# Altium schematic sheet Avometer v1.1.1.SchDoc
size A3
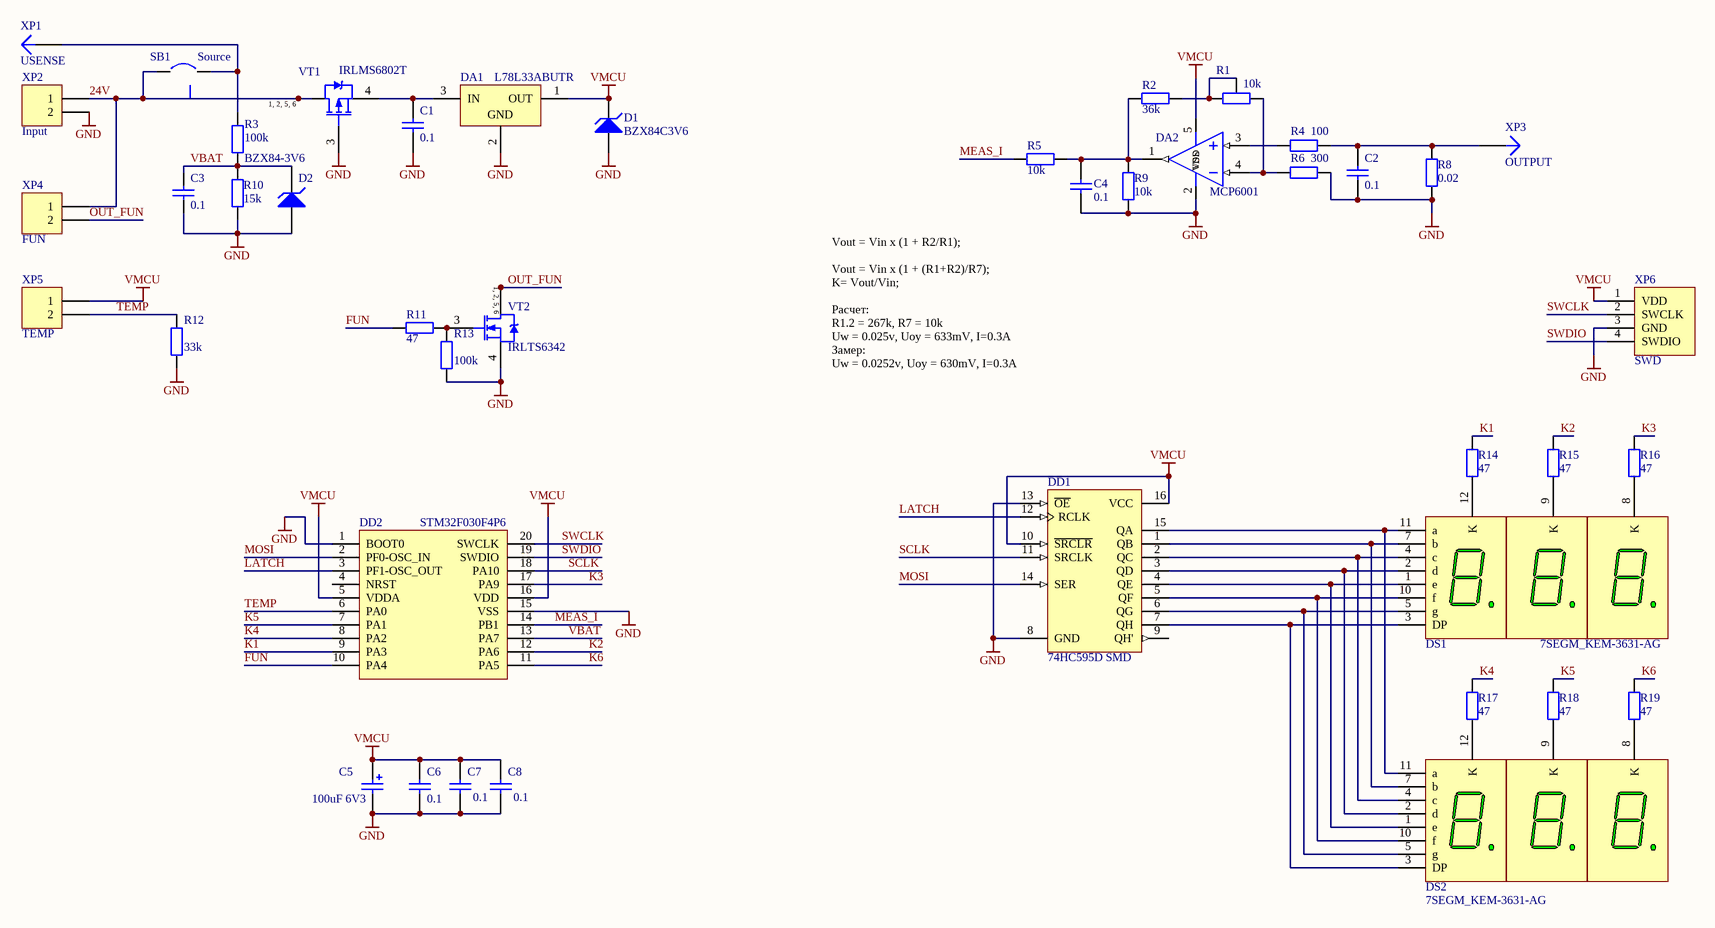
[diagram p0: Avometer v1.1.1.SchDoc]

## Parts
C1  0.1  [CAP 0603_N]
C2  0.1  [CAP 0603_N]
C3  0.1  [CAP 0603_N]
C4  0.1  [CAP 0603_N]
C5  100uF 6V3  [CAP_TANT_B_TYPE_3528-21]
C6  0.1  [CAP 0603_N]
C7  0.1  [CAP 0603_N]
C8  0.1  [CAP 0603_N]
D1  BZX84C3V6  [SOT-23_L]
D2  BZX84-3V6  [SOT-23_L]
DA1  L78L33ABUTR  [SOT-89]
DA2  MCP6001  [SOT-23-5_L]
DD1  74HC595D SMD  [SOIC-16_L]
DD2  STM32F030F4P6  [TSSOP-20_N]
DS1  7SEGM_KEM-3631-AG  [7SEGM_KEM-3631-AG_BLUE]
DS2  7SEGM_KEM-3631-AG  [7SEGM_KEM-3631-AG_RED]
R1  10k  [RES VAR 1]
R2  36k  [RES 0603_N]
R3  100k  [RES 0603_N]
R4  100  [RES 0603_N]
R5  10k  [RES 0603_N]
R6  300  [RES 0603_N]
R8  0.02  [RES 2512]
R9  10k  [RES 0603_N]
R10  15k  [RES 0603_N]
R11  47  [RES 0603_N]
R12  33k  [RES 0603_N]
R13  100k  [RES 0603_N]
R14  47  [RES 0603_N]
R15  47  [RES 0603_N]
R16  47  [RES 0603_N]
R17  47  [RES 0603_N]
R18  47  [RES 0603_N]
R19  47  [RES 0603_N]
SB1  Source  [JUMPER_SOLDERED]
VT1  IRLMS6802T  [SOT-23-6_L]
VT2  IRLTS6342  [TSOP-6]
XP1  USENSE  [CON_PIN]
XP2  Input  [CON_5.08MM_1X2]
XP3  OUTPUT  [CON_PIN]
XP4  FUN  [CON_2.54MM_1X2]
XP5  TEMP  [CON_2.54MM_1X2]
XP6  SWD  [CON_1.27MM_1X4_SWD]

## Nets
GND: C1.1 C2.1 C3.1 C4.1 C5.2 C6.1 C7.2 C8.2 D1.1(A) D2.1(A) DA1.2(GND) DA2.2(VSS) DD1.8(GND) DD1.13(~{OE}) DD2.1(BOOT0) DD2.15(VSS) R6.1 R8.1 R9.1 R10.1 R12.1 R13.1 VT1.3(G) VT2.4(S) XP2.2 XP6.3(GND)
VMCU: C5.1 C6.2 C7.1 C8.1 D1.3(K) DA1.1(OUT) DA2.5(VDD) DD1.10(~{SRCLR}) DD1.16(VCC) DD2.5(VDDA) DD2.16(VDD) XP5.1 XP6.1(VDD)
24V: SB1.1 VT1.1(D) VT1.2(D) VT1.5(D) VT1.6(D) XP2.1 XP4.1
FUN: DD2.10(PA4) R11.2
K1: DD2.9(PA3) R14.2
K2: DD2.12(PA6) R15.2
K3: DD2.17(PA9) R16.2
K4: DD2.8(PA2) R17.2
K5: DD2.7(PA1) R18.2
K6: DD2.11(PA5) R19.2
LATCH: DD1.12(RCLK) DD2.3(PF1-OSC_OUT)
MEAS_I: DD2.14(PB1) R5.1
MOSI: DD1.14(SER) DD2.2(PF0-OSC_IN)
OUT_FUN: VT2.1(D) VT2.2(D) VT2.5(D) VT2.6(D) XP4.2
SCLK: DD1.11(SRCLK) DD2.18(PA10)
SWCLK: DD2.20(SWCLK) XP6.2(SWCLK)
SWDIO: DD2.19(SWDIO) XP6.4(SWDIO)
TEMP: DD2.6(PA0) R12.2 XP5.2
VBAT: C3.2 D2.3(K) DD2.13(PA7) R3.1 R10.2
NetC1_2: C1.2 DA1.3(IN) VT1.4(S)
NetC2_2: C2.2 R4.1 R8.2 XP3.1
NetC4_2: C4.2 DA2.1(VOUT) R2.2 R5.2 R9.2
NetDA2_3: DA2.3(VIN+) R4.2
NetDA2_4: DA2.4(VIN-) R1.3(B) R6.2
NetDD1_1: DD1.1(QB) DS1.7(b) DS2.7(b)
NetDD1_2: DD1.2(QC) DS1.4(c) DS2.4(c)
NetDD1_3: DD1.3(QD) DS1.2(d) DS2.2(d)
NetDD1_4: DD1.4(QE) DS1.1(e) DS2.1(e)
NetDD1_5: DD1.5(QF) DS1.10(f) DS2.10(f)
NetDD1_6: DD1.6(QG) DS1.5(g) DS2.5(g)
NetDD1_7: DD1.7(QH) DS1.3(DP) DS2.3(DP)
NetDD1_15: DD1.15(QA) DS1.11(a) DS2.11(a)
NetDS1_8: DS1.8(K) R16.1
NetDS1_9: DS1.9(K) R15.1
NetDS1_12: DS1.12(K) R14.1
NetDS2_8: DS2.8(K) R19.1
NetDS2_9: DS2.9(K) R18.1
NetDS2_12: DS2.12(K) R17.1
NetR1_1: R1.1(A) R1.2(TAP) R2.1
NetR3_2: R3.2 SB1.2 XP1.1
NetR11_1: R11.1 R13.2 VT2.3(G)

Not connected (* = marked no-connect by the designer): DD1 9(QH'); DD2 4(NRST)

## Notes on the sheet
- Vout = Vin x (1 + R2/R1);
  Vout = Vin x (1 + (R1+R2)/R7);
  K= Vout/Vin;
  Расчет:
  R1.2 = 267k, R7 = 10k
  Uw = 0.025v, Uoy = 633mV, I=0.3A
  Замер:
  Uw = 0.0252v, Uoy = 630mV, I=0.3A
- (in symbol IRLMS6802T) 1, 2, 5, 6
- (in symbol IRLTS6342) 1, 2, 5, 6

## Library data of the parts
C1 C2 C4 C6-C8 = CAP_SMD: Capacitor SMD
C3 = CAP_SMD
C5 = CAP_SMD_TANT: Capacitor SMD Tantalum
D1 D2 = BZX84: Zener Diode; Published: 8-Jun-2000; LatestRevisionDate: 17-Jul-2002; LatestRevisionNote: Re-released for DXP Platform.; PackageReference: DIODE-0.7; Publisher: Altium Limited; PackageDescription: Diode, Thru-Hole; 2 Leads; 0.7 in Pin Spacing
DA1 = L78L33ABUTR: Vin=30V Positive Voltage Regulator; Published: 24-Aug-2001; LatestRevisionDate: 17-Jul-2002; LatestRevisionNote: Re-released for DXP Platform.; DatasheetVersion: Feb-1999; PackageReference: TO92; Publisher: Altium Limited; PackageDescription: TO, Flat Index; 3 In-Line, Axial Leads; Body Dia. 4.8mm; Leads 0.51 x 0.51 mm (max); ComponentLink1Description: Manufacturer Link; ComponentLink1URL: http://www.st.com/
DA2 = MCP6001: 1 MHz, Low-Power Op Amp
DD1 = 74HC595D SMD: 8-Bit Shift Register with 3-State Output Registers; Published: 8-Jun-2000; LatestRevisionDate: 13-Apr-2006; LatestRevisionNote: IPC-7351 Footprint Added.; DatasheetVersion: May-1997; PackageVersion: Jan-1998; PackageReference: D016; Publisher: Altium Limited; PackageDescription: 16-Pin Small Outline Integrated Circuit 1.27 mm Pitch; Code_IPC: SOIC127P600-16; ComponentLink1Description: Manufacturer Link; ComponentLink1URL: http://www.ti.com/; ComponentLink2Description: Datasheet; ComponentLink2URL: http://www-s.ti.com/sc/ds/sn74hc595.pdf
DD2 = STM32F030F4P6: Cortex-M0 32-bit MCU, 16 KB Flash, 4 KB Internal RAM, 15 I/Os, 20-pin TSSOP, -40 to 85 degC
DS1 DS2 = 7SEGM_KEM-3631-AG: 7.62 mm Black Surface Green 7-Segment Display: CC, RH DP; MinimumIntensity: 860 ucd; Note: IF = 10 mA; Note: Pins 1 and 6 are redundant Cathodes.; Published: 8-Jun-2000; LatestRevisionDate: 17-Dec-2003; LatestRevisionNote: Schematic revised, PCB Footprint replaced.; DatasheetVersion: 19-Feb-2002; PackageVersion: 11-Feb-2002; PackageReference: A; Publisher: Altium Limited; PackageDescription: LED, 7-Segment Display, 7.62 mm, RHD; 10 Leads; Row Space 5.08 mm; Pitch 2.54 mm; Colour: Green; ComponentLink1Description: Manufacturer Link; ComponentLink1URL: http://www.agilent.com/
R1 = RES_SMD_Tap: Tapped Resistor; Sim Note: Enter the Resistance value and the set point into parameter fields.; Set Position: 0.5; Published: 24-Mar-1999; LatestRevisionDate: 17-Jul-2002; LatestRevisionNote: Re-released for DXP Platform.; PackageReference: VR3; Publisher: Altium Limited; PackageDescription: Variable Resistor, Thru-Hole; 3 Leads
R2 R4 R6 R9 R14-R19 = Resistor_SMD
R3 R10 = RES_SMD
R5 R8 = RES_SMD: Resistor
R11-R13 = RES_SMD: Chip Resistor
SB1 = Jumper_SMD: Jumper
VT1 = IRLMS6802T: P-Channel MOSFET 20V 4.5A; Published: 8-Jun-2000; LatestRevisionDate: 13-Apr-2006; LatestRevisionNote: IPC-7351 Footprint Added.; DatasheetVersion: Aug-1997; PackageVersion: Feb-2001; PackageReference: SO-8; Publisher: Altium Limited; PackageDescription: 8-Pin Plastic Small Outline Integrated Circuit 1.27 mm Pitch; Code_JEDEC: MS-012-AA; Code_IPC: SOIC127P600-8; ComponentLink1Description: Manufacturer Link; ComponentLink1URL: http://www.irf.com/; ComponentLink2Description: Datasheet; ComponentLink2URL: http://www.irf.com/product-info/datasheets/data/irf7416.pdf
VT2 = IRLTS6342: 30V, 6.7A, 1V N-Channel MOSFET; Note: Pin 2 is electrically connected to pin 4.; Published: 8-Jun-2000; LatestRevisionDate: 17-Jul-2002; LatestRevisionNote: Re-released for DXP Platform.; DatasheetVersion: Aug-1997; PackageVersion: Feb-1997; PackageReference: TO-220AB; Publisher: Altium Limited; PackageDescription: TO, Thru-Hole, Vertical, Heatsink Mounted; 3 In-Line Leads; Pitch 2.54 mm; ComponentLink1Description: Manufacturer Link; ComponentLink1URL: http://www.irf.com/; ComponentLink2Description: Datasheet; ComponentLink2URL: http://www.irf.com/product-info/datasheets/data/irlz34n.pdf
XP1 XP3 = CON_1x1_PIN: Plug papa; LatestRevisionDate: 17-Jul-2002; LatestRevisionNote: Re-released for DXP Platform.; Publisher: Altium Limited
XP2 = CON_5.08mm_1x2: Header, 2-Pin; LatestRevisionDate: 17-Jul-2002; LatestRevisionNote: Re-released for DXP Platform.; Publisher: Altium Limited
XP4 XP5 = CON_2.54mm_1x2: Header, 2-Pin; LatestRevisionDate: 17-Jul-2002; LatestRevisionNote: Re-released for DXP Platform.; Publisher: Altium Limited
XP6 = CON_1.27mm_1x4_SWD: Header, 3-Pin; LatestRevisionDate: 17-Jul-2002; LatestRevisionNote: Re-released for DXP Platform.; Publisher: Altium Limited